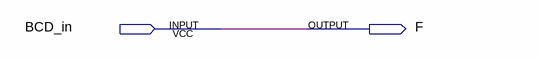
[diagram p0: schematic sheet]
// Quartus schematic DECOD_BCD_F.bdf as structural Verilog: 0 symbols, 2 pins
module DECOD_BCD_F (
  input  BCD_in,
  output F
);


  assign F = BCD_in;
endmodule
